# Altium project Mixed Signal Design Board.PrjPcb (part 2 of 2)

## Sheet Power and Regulator.SchDoc: Nilay Nandimath
size A4; Organization: ORGANIZATION; Address1: ADDRESS 1; Address2: ADDRESS 2; Address3: ADDRESS 3; Address4: ADDRESS 4; Revision: -; SheetNumber: 11; SheetTotal: 11; ENG_APP_DATE: --/--/--; DSN_APP_DATE: --/--/--; CHK_APP_DATE: --/--/--
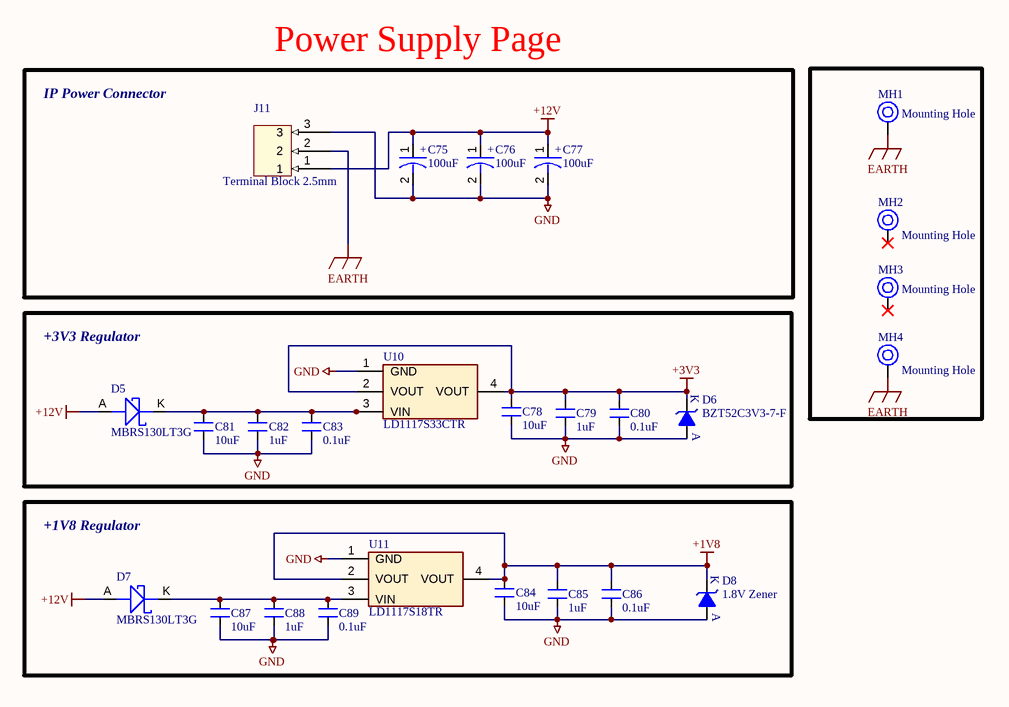
[diagram p10: Power and Regulator.SchDoc]

### Parts
C75  100uF  [ACAP_P305_D393_H393_RAD]
C76  100uF  [ACAP_P305_D393_H393_RAD]
C77  100uF  [ACAP_P305_D393_H393_RAD]
C78  10uF  [CAP_1206]
C79  1uF  [CAP_0805]
C80  0.1uF  [CAP_0805]
C81  10uF  [CAP_1206]
C82  1uF  [CAP_0805]
C83  0.1uF  [CAP_0805]
C84  10uF  [CAP_1206]
C85  1uF  [CAP_0805]
C86  0.1uF  [CAP_0805]
C87  10uF  [CAP_1206]
C88  1uF  [CAP_0805]
C89  0.1uF  [CAP_0805]
D5  MBRS130LT3G  [DIO_SMB_DO-214AA]
D6  BZT52C3V3-7-F  [DIO_SOD-123]
D7  MBRS130LT3G  [DIO_SMB_DO-214AA]
D8  1.8V Zener  [DIO_DO-213AB_SMD]
J11  Terminal Block 2.5mm  [CON3_100_TB_TH_ST]
MH1  Mounting Hole  [MOUNTING]
MH2  Mounting Hole  [MOUNTING]
MH3  Mounting Hole  [MOUNTING]
MH4  Mounting Hole  [MOUNTING]
U10  LD1117S33CTR  [SOT223_3]
U11  LD1117S18TR  [SOT223_3]

### Blocks framed on the sheet
Power Supply Page: C75-C77 J11
+3V3 Regulator: C78-C83 D5 D6 U10
+1V8 Regulator: C84-C89 D7 D8 U11

### Nets
+1V8: C84.2 C85.2 C86.2 D8.K U11.2(VOUT) U11.4(VOUT)
+3V3: C78.2 C79.2 C80.2 D6.K U10.2(VOUT) U10.4(VOUT)
+12V: C75.1 C76.1 C77.1 D5.A D7.A J11.1
EARTH: J11.2 MH1.1 MH4.1
GND: C75.2 C76.2 C77.2 C78.1 C79.1 C80.1 C81.1 C82.1 C83.1 C84.1 C85.1 C86.1 C87.1 C88.1 C89.1 D6.A D8.A J11.3 U10.1(GND) U11.1(GND)
NetC81_2: C81.2 C82.2 C83.2 D5.K U10.3(VIN)
NetC87_2: C87.2 C88.2 C89.2 D7.K U11.3(VIN)

Not connected (* = marked no-connect by the designer): MH2 1*; MH3 1*

### Notes on the sheet
- IP Power Connector
- DWG. NO.
- REV.
- SHT.
- THIS DOCUMENT AND THE DATA DISCLOSED HEREIN OR HEREWITH IS THE PROPERTY OF ALTIUM LIMITED AND MAY BE FREELY DISTRIBUTED IN WHOLE. NO RIGHTS ARE RESERVED OR EXPRESS OR IMPLIED WARANTEE GIVEN.
- REVISION
- DESCRIPTION
- DATE
- APPROVED
- ENG:
- APPROVALS
- PROJECT
- DSN:
- CHK:
- REFERENCE DOCUMENTS
- PROJECT REVISION:
- TITLE
- DOCUMENT REVISION:
- DESIGN ITEM:
- BOM:
- FAB DWG:
- PCB DWG:
- ASSY DWG:
- SCALE:
- SIZE
- B
- CAGE CODE
- FILE NAME
- DWG NO.
- SHEET
- OF
- REV
- (in symbol CAP-P_100uF-50V-20%-RAD) +

### Library data of the parts
C75-C77 = CAP-P_100uF-50V-20%-RAD: 100µF 50V Aluminum Polymer Capacitor Radial, Can - SMD 28mOhm 4000 Hrs @ 125°C; Manufacturer: Nichicon; Manufacturer Part Number: GYA1H101MCQ1GS; Alternate Part Number-1: VEU101M1HTR-1010; Case/Package: Radial-SMD; Supplier-1: SP ROAD; Supplier Part Number-1: GYA1H101MCQ1GS
C78 C81 C84 C87 = CAP_10uF-50V-10%-1206: 10µF ±10% 50V Ceramic Capacitor X7R 1206 (3216 Metric); Manufacturer: KEMET; Manufacturer Part Number: CL31B106KBHNNNE; Alternate Part Number-1: GRT31CR61H106ME01L; Case/Package: 1206; Supplier-1: SIRICOM; Supplier Part Number-1: CC1206KKX5R9BB106
C79 C82 C85 C88 = CAP_1uF-50V-5%-0805: 1µF ±5% 50V Ceramic Capacitor X7R 0805 (2012 Metric); Manufacturer: Samsung; Manufacturer Part Number: CC0805JKX7R9BB105; Alternate Part Number-1: 0805F105M500NT; Case/Package: 0805; Supplier-1: SIRICOM; Supplier Part Number-1: CL21B105KBFNNNE
C80 C83 C86 C89 = CAP_0.1uF-50V-20%-0805: 0.1µF ±20% 50V Ceramic Capacitor X7R 0805 (2012 Metric); Manufacturer: Samsung Electro-Mechanics; Manufacturer Part Number: CL21B104MBCNNNC; Alternate Part Number-1: NA; Case/Package: 0805; Supplier-1: SIRICOM; Supplier Part Number-1: 0805B104K500CT
D5 D7 = DIO-S_445mV-30V-2A-SMB: Diode Schottky 30V 2A Surface Mount SMB; Manufacturer: ON Semiconductor; Alternate Part Number-1: NA; Manufacturer Part Number: MBRS130LT3G; Case/Package: SMB; Supplier-1: ARROW; Supplier Part Number-1: MBRS130LT3G
D6 = DIO-Z_3.3V-500mW-SOD123: Zener Diode 3.3V 500mW ±6% Surface Mount SOD-123; Manufacturer: Diodes Incorporated; Alternate Part Number-1: NA; Manufacturer Part Number: BZT52C3V3-7-F; Case/Package: SOD-123; Supplier-1: Digikey; Supplier Part Number-1: BZT52C3V3-FDICT-ND
D8 = DIO-Z_1.8V-500mW-DO213AA: Zener Diode 1.8V 500mW ±5% Surface Mount DO-213AA; Manufacturer: *; Manufacturer Part Number: *; Case/Package: *; Supplier-1: *; Supplier Part Number-1: *; Alternate Part Number-1: *
J11 = CON-TB_3X1-100-ST-TH: 3 Pins, 1 Row 2.54mm Pitch, straight Connector, male; Manufacturer Part Number: 1725669; Manufacturer: Phoenix Contact; Alternate Part Number-1: NA; Case/Package: TH-CON; Supplier-1: SP ROAD; Supplier Part Number-1: 1725669
MH1-MH4 = MH_3.5H_6D: Manufacturer Part Number: NA; Case/Package: TH; Manufacturer: NA; Supplier-1: NA; Supplier Part Number-1: NA; Alternate Part Number-1: NA
U10 = REG_15V-3.3V-0.9A-12W-SOT223: Linear Voltage Regulator IC 1 Output 800mA SOT-223; Manufacturer: STMicroelectronics; Alternate Part Number-1: NA; Manufacturer Part Number: LD1117S33CTR; Case/Package: SOT223; Supplier-1: SP ROAD; Supplier Part Number-1: LD1117S33CTR
U11 = REG_15V-1.8V-0.8A-1.4W-SOT223: LDO Voltage Regulators 1.8V 0.8A Positive; Manufacturer: STMicroelectronics; Alternate Part Number-1: NA; Manufacturer Part Number: LD1117S18TR; Case/Package: SOT-223-3; Supplier-1: Mouser; Supplier Part Number-1: 511-LD1117S18-TR

## Nets that join several sheets
+1V8: DAC_MIC (C35.2 C36.2 FB3.1 U6.34), Power and Regulator (6 pins)
+3V3: STM32F103 (14 pins), Ethernet PHY (10 pins), Motor Driver (R21.1), UART to TTL (C27.2 U4.4 U4.16), ADC (8 pins), DAC_MIC (12 pins), Motor Driver_2 (R42.1), STM32F407 (20 pins), Power and Regulator (6 pins)
+12V: Motor Driver (7 pins), Motor Driver_2 (6 pins), Power and Regulator (6 pins)
EARTH: Ethernet PHY (C21.1 R10.1), Power and Regulator (J11.2 MH1.1 MH4.1)
GND: STM32F103 (19 pins), Ethernet PHY (20 pins), Motor Driver (12 pins), UART to TTL (C27.1 J5.5 J5.6 U4.1), ADC (10 pins), DAC_MIC (25 pins), Motor Driver_2 (11 pins), STM32F407 (28 pins), Power and Regulator (20 pins)
CH340_RST: UART to TTL (U4.14), STM32F407 (U9.57)
CH340_RXD: UART to TTL (U4.3), STM32F407 (U9.79)
CH340_TXD: UART to TTL (U4.2), STM32F407 (U9.78)
CLK_MIC: DAC_MIC (U7.3), STM32F407 (U9.65)
COL: Ethernet PHY (DS1.A U2.28), STM32F407 (U9.26)
CRS: Ethernet PHY (DS2.A U2.29), STM32F407 (U9.23)
DOUT_MIC: DAC_MIC (U7.4), STM32F407 (U9.53)
DRDY: ADC (U5.14), STM32F407 (U9.56)
EN: Motor Driver (R24.2 U3.14), STM32F407 (U9.45)
EN_2: Motor Driver_2 (R45.2 U8.14), STM32F407 (U9.66)
JTCLK_F407: STM32F103 (U1.18), STM32F407 (U9.76)
LRCK: DAC_MIC (U6.40), STM32F407 (U9.90)
MCLK: DAC_MIC (U6.37), STM32F407 (U9.29)
MDC: Ethernet PHY (U2.12), STM32F407 (U9.16)
MDIO: Ethernet PHY (R11.1 U2.11), STM32F407 (U9.25)
NetU1_25: STM32F103 (U1.25 U1.27), STM32F407 (U9.72)
nFAULT: Motor Driver (R23.1 U3.9), STM32F407 (U9.62)
nFAULT_2: Motor Driver_2 (R44.1 U8.9), STM32F407 (U9.59)
NTRST_F407: STM32F103 (U1.26), STM32F407 (C59.2 R46.1 SW3.2 U9.14)
PH: Motor Driver (U3.15), STM32F407 (U9.63)
PH_2: Motor Driver_2 (U8.15), STM32F407 (U9.60)
PHY_RESET: Ethernet PHY (R6.1 SW2.2 U2.32), STM32F407 (U9.64)
RESET: ADC (R27.1 U5.3), STM32F407 (U9.55)
RESET_DAC: DAC_MIC (R32.1 U6.32), STM32F407 (U9.54)
RX_CLK: Ethernet PHY (U2.19), STM32F407 (U9.24)
RX_D0: Ethernet PHY (U2.16), STM32F407 (U9.34)
RX_D1: Ethernet PHY (U2.15), STM32F407 (U9.33)
RX_D2: Ethernet PHY (U2.14), STM32F407 (U9.35)
RX_D3: Ethernet PHY (U2.13), STM32F407 (U9.36)
RX_DV: Ethernet PHY (U2.18), STM32F407 (U9.32)
RX_ER: Ethernet PHY (U2.20), STM32F407 (U9.47)
SCL: ADC (R26.1 U5.16), DAC_MIC (U6.2), STM32F407 (U9.92)
SCLK: DAC_MIC (U6.38), STM32F407 (U9.89)
SDA: ADC (R25.1 U5.15), DAC_MIC (U6.1), STM32F407 (U9.93)
SDIN: DAC_MIC (U6.39), STM32F407 (U9.80)
SNSOUT: Motor Driver (R22.1 U3.10), STM32F407 (U9.61)
SNSOUT_2: Motor Driver_2 (R43.1 U8.10), STM32F407 (U9.58)
SO: Motor Driver (U3.11), STM32F407 (U9.30)
SO_2: Motor Driver_2 (U8.11), STM32F407 (U9.31)
TX_CLK: Ethernet PHY (U2.22), STM32F407 (U9.18)
TX_D0: Ethernet PHY (U2.24), STM32F407 (U9.51)
TX_D1: Ethernet PHY (U2.25), STM32F407 (U9.52)
TX_D2: Ethernet PHY (U2.26), STM32F407 (U9.17)
TX_D3: Ethernet PHY (U2.27), STM32F407 (U9.1)
TX_EN: Ethernet PHY (U2.23), STM32F407 (U9.48)